# Altium schematic sheet TFT_Ticketing_Master.SchDoc
size A4; Organization: ETML-ES; Address1: Avenue Recordon 1; Address2: 1004 Lausanne; Address3: Switzerland
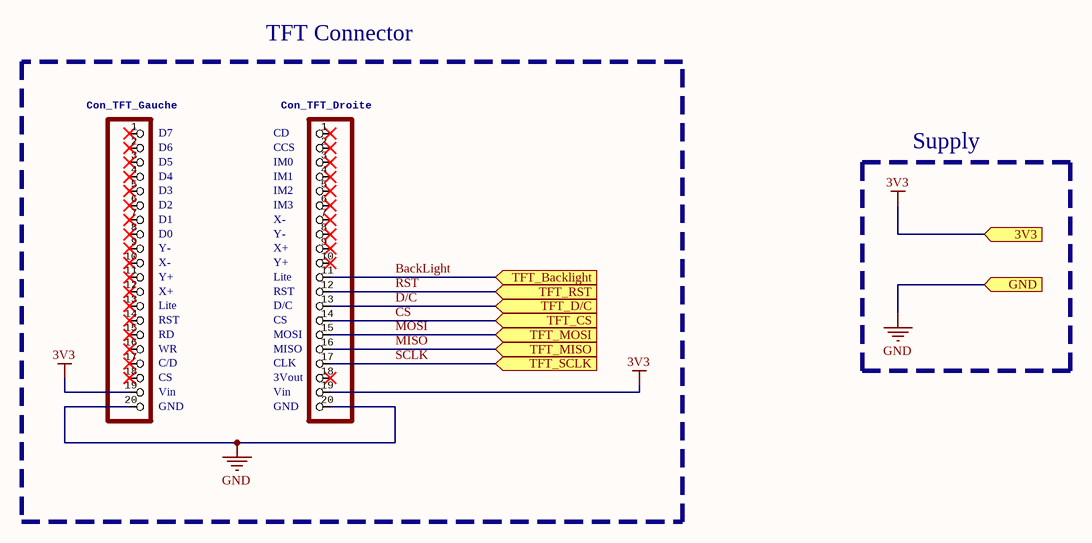
[diagram p0: TFT_Ticketing_Master.SchDoc]

## Parts
Con_TFT_Droite  HEADER-1X20ROUND  [HDR1X20]  (value not drawn)
Con_TFT_Gauche  HEADER-1X20ROUND  [HDR1X20]  (value not drawn)

## Blocks framed on the sheet
TFT Connector: Con_TFT_Droite Con_TFT_Gauche

## Ports
3V3, GND, TFT_Backlight, TFT_CS, TFT_D/C, TFT_MISO, TFT_MOSI, TFT_RST, TFT_SCLK

## Nets
3V3: Con_TFT_Droite.19 Con_TFT_Gauche.19 ; port 3V3
GND: Con_TFT_Droite.20 Con_TFT_Gauche.20 ; port GND
BackLight: Con_TFT_Droite.11 ; port TFT_Backlight
CS: Con_TFT_Droite.14 ; port TFT_CS
D/C: Con_TFT_Droite.13 ; port TFT_D/C
MISO: Con_TFT_Droite.16 ; port TFT_MISO
MOSI: Con_TFT_Droite.15 ; port TFT_MOSI
RST: Con_TFT_Droite.12 ; port TFT_RST
SCLK: Con_TFT_Droite.17 ; port TFT_SCLK

Not connected (* = marked no-connect by the designer): Con_TFT_Droite 1* 2* 3* 4* 5* 6* 7* 8* 9* 10* 18*; Con_TFT_Gauche 1* 2* 3* 4* 5* 6* 7* 8* 9* 10* 11* 12* 13* 14* 15* 16* 17* 18*

## Notes on the sheet
- (near Con_TFT_Gauche) D7
- (near Con_TFT_Gauche) D6
- (near Con_TFT_Gauche) D5
- (near Con_TFT_Gauche) D4
- (near Con_TFT_Droite) CD
- (near Con_TFT_Droite) CCS
- (near Con_TFT_Droite) IM0
- (near Con_TFT_Droite) IM1
- Supply
- (near Con_TFT_Gauche) D3
- (near Con_TFT_Gauche) D2
- (near Con_TFT_Gauche) D1
- (near Con_TFT_Gauche) D0
- (near Con_TFT_Gauche) Y-
- (near Con_TFT_Gauche) X-
- (near Con_TFT_Droite) IM2
- (near Con_TFT_Droite) IM3
- (near Con_TFT_Droite) X-
- (near Con_TFT_Droite) Y-
- (near Con_TFT_Droite) X+
- (near Con_TFT_Droite) Y+
- (near Con_TFT_Gauche) Y+
- (near Con_TFT_Gauche) X+
- (near Con_TFT_Gauche) Lite
- (near Con_TFT_Gauche) RST
- (near Con_TFT_Droite) Lite
- (near Con_TFT_Droite) RST
- (near Con_TFT_Droite) D/C
- (near Con_TFT_Droite) CS
- (near Con_TFT_Gauche) RD
- (near Con_TFT_Gauche) WR
- (near Con_TFT_Gauche) C/D
- (near Con_TFT_Gauche) CS
- (near Con_TFT_Gauche) Vin
- (near Con_TFT_Gauche) GND
- (near Con_TFT_Droite) MOSI
- (near Con_TFT_Droite) MISO
- (near Con_TFT_Droite) CLK
- (near Con_TFT_Droite) 3Vout
- (near Con_TFT_Droite) Vin
- (near Con_TFT_Droite) GND
- Fichier :
- Date :
- Heure :
- Projet :
- Auteur :
- Version :
- Chemin :